# EAGLE design FlashAdapter (EAGLE 9.6.2)
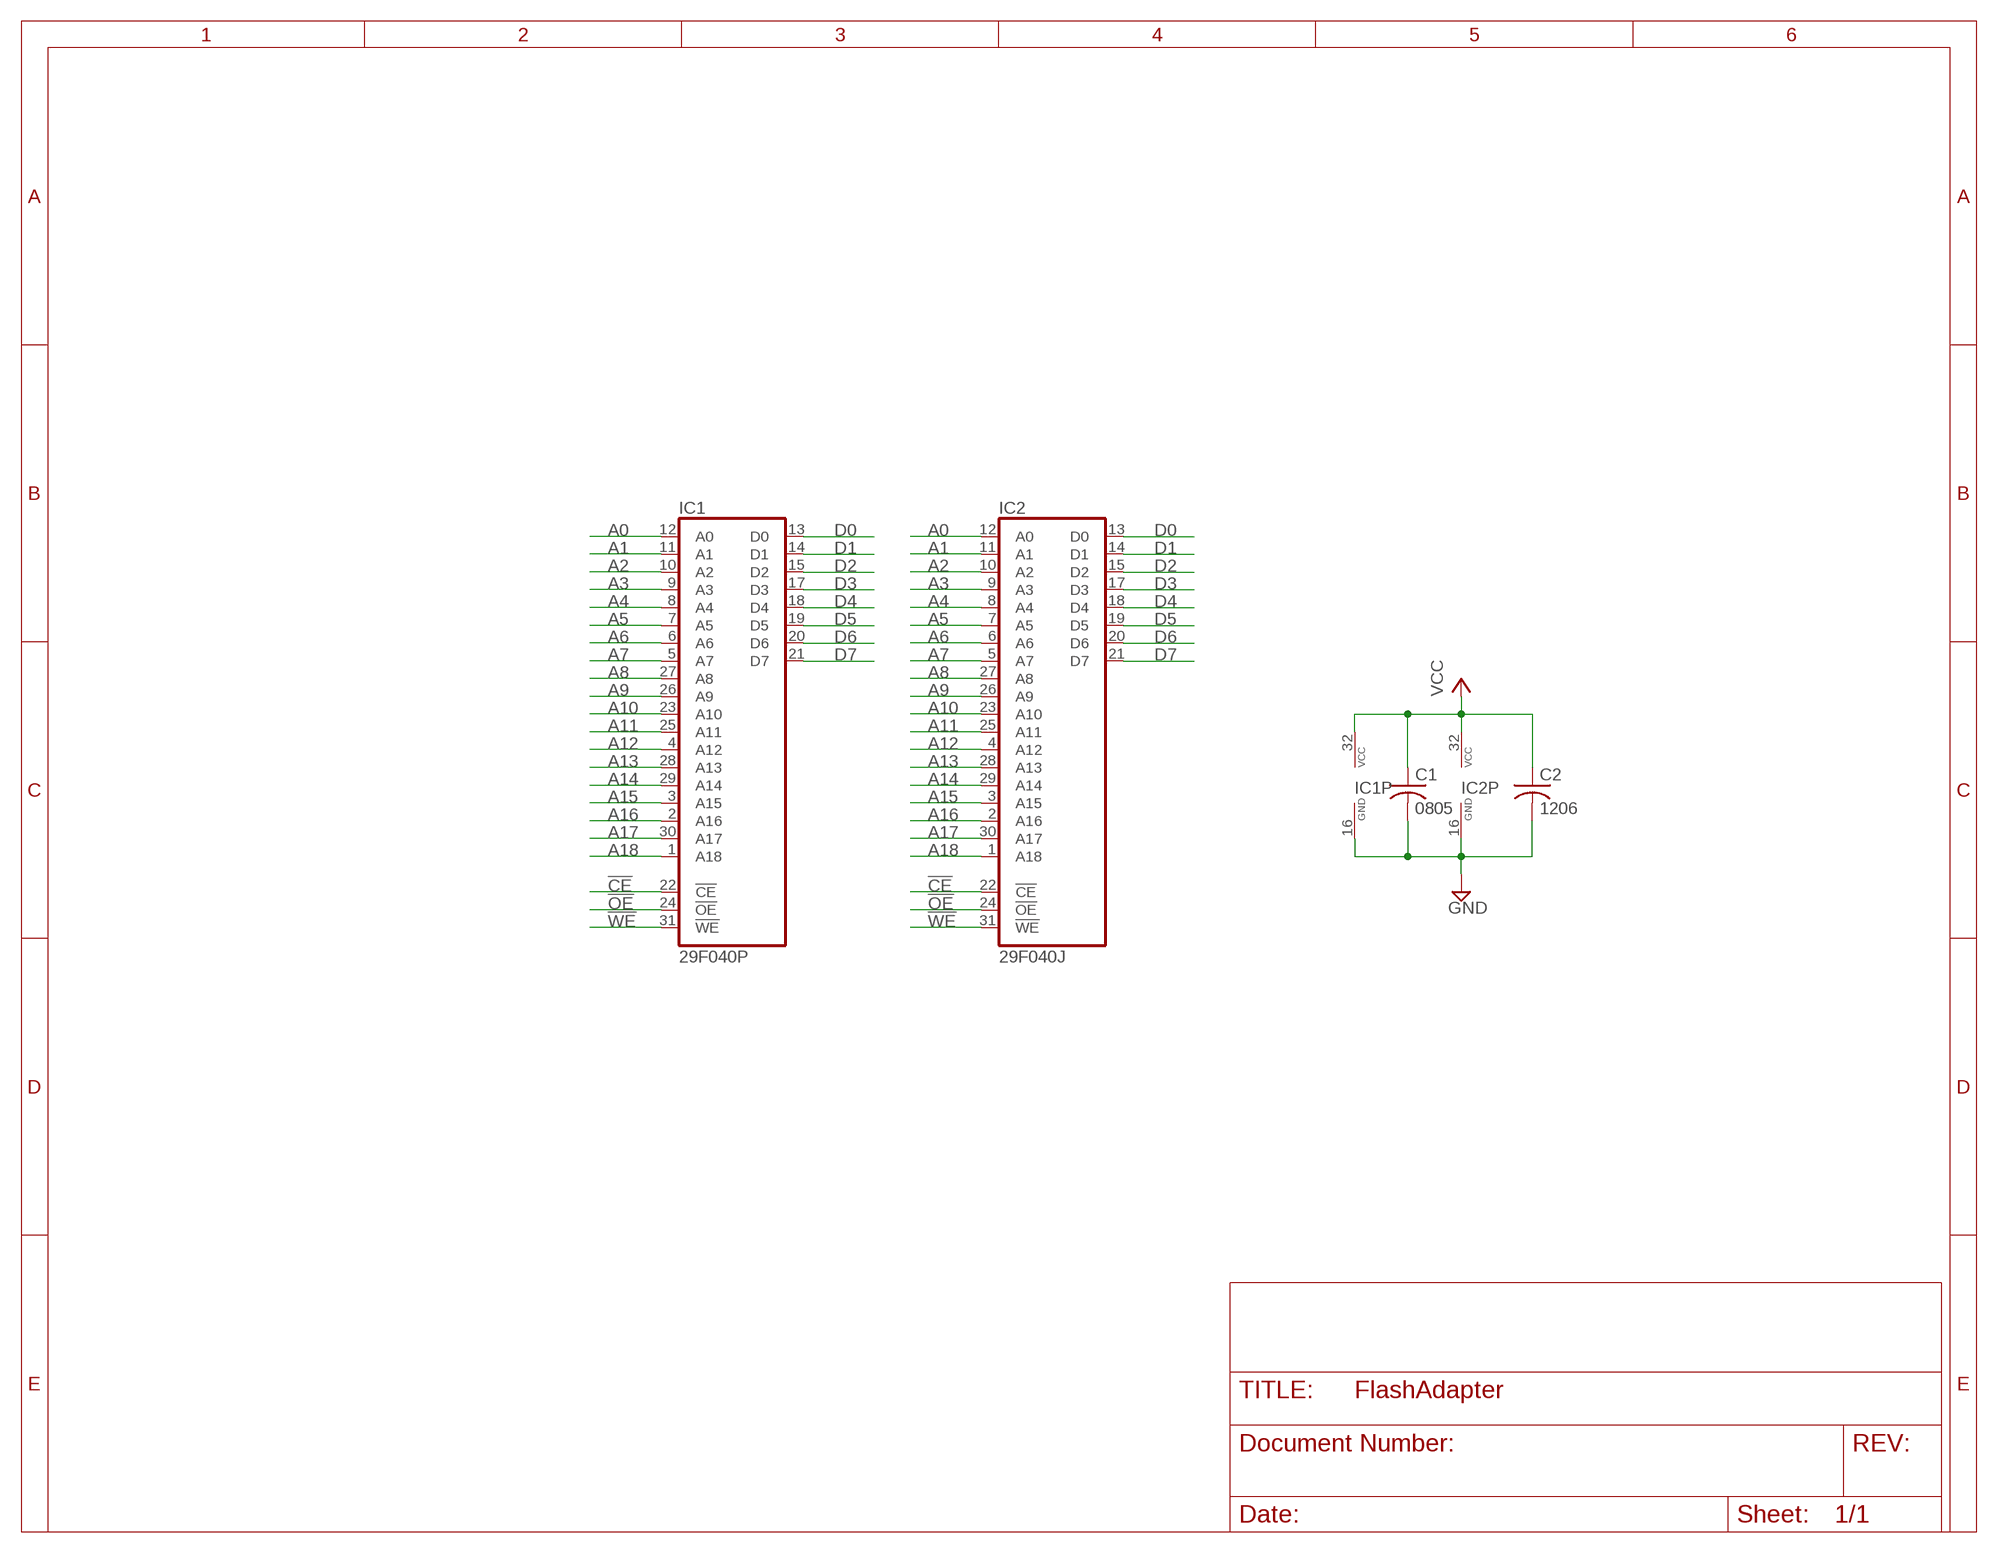
[diagram p0: schematic, sheet 1]

## Parts
C1  0805  C-USC0805  [C0805]
C2  1206  C-USC1206  [C1206]
IC1  29F040P  [DIL32-3]
IC2  29F040J  [S32]

## Nets
!CE: IC1.22(!CE) IC2.22(!CE)
!OE: IC1.24(!OE) IC2.24(!OE)
!WE: IC1.31(!WE) IC2.31(!WE)
A0: IC1.12(A0) IC2.12(A0)
A1: IC1.11(A1) IC2.11(A1)
A2: IC1.10(A2) IC2.10(A2)
A3: IC1.9(A3) IC2.9(A3)
A4: IC1.8(A4) IC2.8(A4)
A5: IC1.7(A5) IC2.7(A5)
A6: IC1.6(A6) IC2.6(A6)
A7: IC1.5(A7) IC2.5(A7)
A8: IC1.27(A8) IC2.27(A8)
A9: IC1.26(A9) IC2.26(A9)
A10: IC1.23(A10) IC2.23(A10)
A11: IC1.25(A11) IC2.25(A11)
A12: IC1.4(A12) IC2.4(A12)
A13: IC1.28(A13) IC2.28(A13)
A14: IC1.29(A14) IC2.29(A14)
A15: IC1.3(A15) IC2.3(A15)
A16: IC1.2(A16) IC2.2(A16)
A17: IC1.30(A17) IC2.30(A17)
A18: IC1.1(A18) IC2.1(A18)
D0: IC1.13(D0) IC2.13(D0)
D1: IC1.14(D1) IC2.14(D1)
D2: IC1.15(D2) IC2.15(D2)
D3: IC1.17(D3) IC2.17(D3)
D4: IC1.18(D4) IC2.18(D4)
D5: IC1.19(D5) IC2.19(D5)
D6: IC1.20(D6) IC2.20(D6)
D7: IC1.21(D7) IC2.21(D7)
GND: C1.2 C2.2 IC1.16(GND) IC2.16(GND)
VCC: C1.1 C2.1 IC1.32(VCC) IC2.32(VCC)

## Library data of the parts
C1 C2 = FlashAdapter:C-US: CAPACITOR, American symbol; SPICEPREFIX: C
IC1 IC2 = FlashAdapter:29F040: 4-Megabit FLASH MEMORY (512 K x 8 bit) 5 V-only

## Board
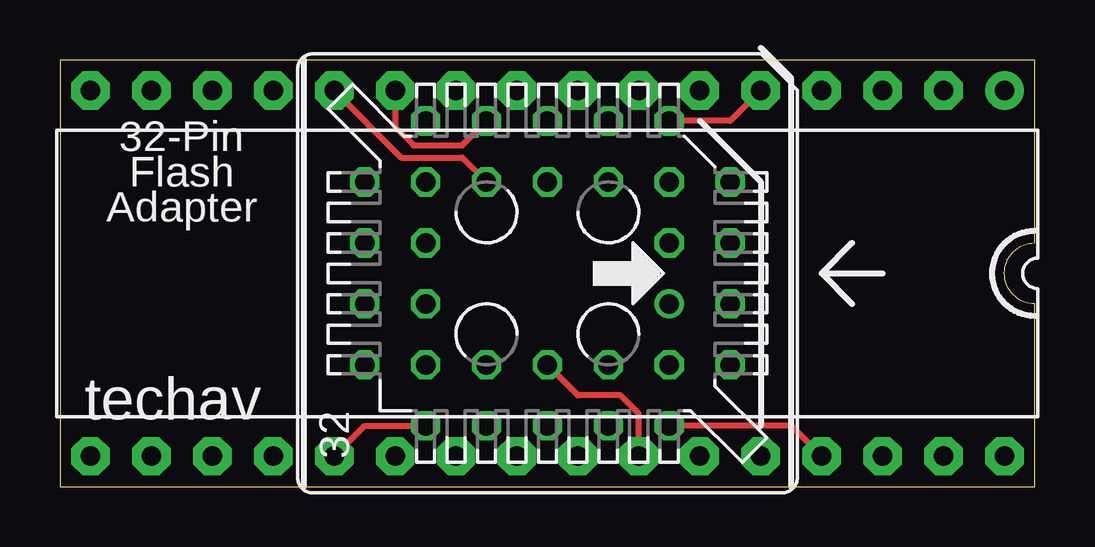
[diagram p1: board, top side]
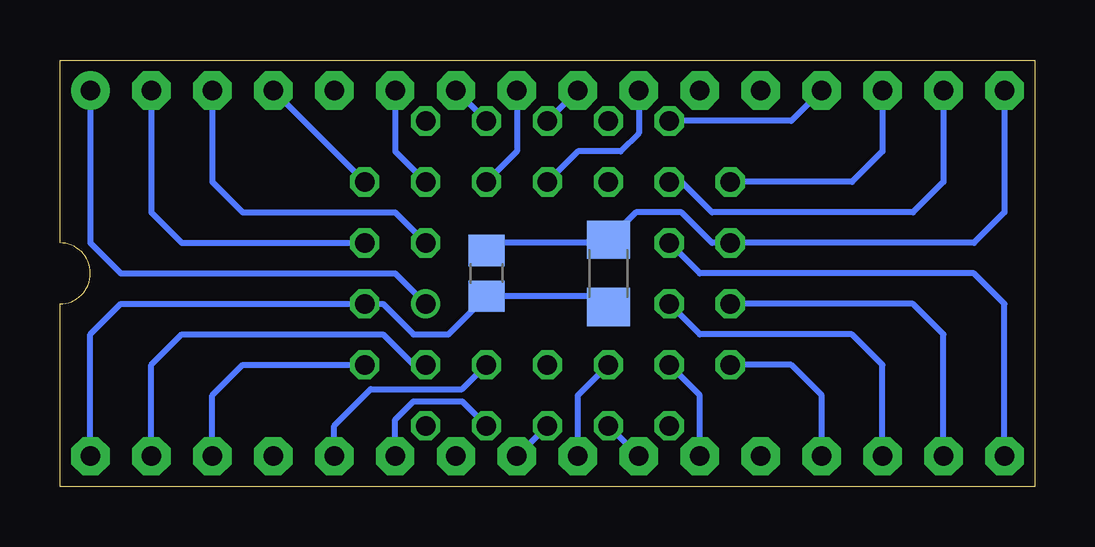
[diagram p2: board, bottom side, seen from below]

Size 40.64 x 17.78 mm. Coordinates in mm from the lower left corner, seen from the top.
Outline: 0,17.78 0,0 40.64,0 40.64,7.62 arc-180 40.64,10.16 40.64,17.78 0,17.78
Copper layers (1*16): Top 0.0356mm / dielectric 1.5011mm / Bottom 0.0356mm
Design rules "oshpark-2layer": minimum track width 6mil, minimum drill 13mil, track to track 6mil, track to pad 6mil, pad to pad 6mil, via to via 6mil, smd to smd 6mil, copper to edge 15mil, drill to drill 6mil, minimum pad ring 7mil, minimum via ring 7mil, stop-mask expansion 4mil, vias tented up to drill 0mil, thermal gap 10mil

### Footprints (pad centres in the part's own frame; a part is rotated, then mirrored left to right if it is on the bottom)
C0805 = smd 1.3 x 1.5: 1 -0.95,0; 2 0.95,0
C1206 = smd 1.6 x 1.8: 1 -1.4,0; 2 1.4,0
DIL32-3 = drill 0.813 pad 1.6: 1 -19.05,-7.62 | drill 0.813 pad 1.6 octagon: 2 -16.51,-7.62; 3 -13.97,-7.62; 4 -11.43,-7.62; 5 -8.89,-7.62; 6 -6.35,-7.62; 7 -3.81,-7.62; 8 -1.27,-7.62; 9 1.27,-7.62; 10 3.81,-7.62; 11 6.35,-7.62; 12 8.89,-7.62; 13 11.43,-7.62; 14 13.97,-7.62; 15 16.51,-7.62; 16 19.05,-7.62; 17 19.05,7.62; 18 16.51,7.62; 19 13.97,7.62; 20 11.43,7.62; 21 8.89,7.62; 22 6.35,7.62; 23 3.81,7.62; 24 1.27,7.62; 25 -1.27,7.62; 26 -3.81,7.62; 27 -6.35,7.62; 28 -8.89,7.62; 29 -11.43,7.62; 30 -13.97,7.62; 31 -16.51,7.62; 32 -19.05,7.62
S32 = drill 0.813: 1 1.27,5.08 | drill 0.813 octagon: 2 -1.27,7.62; 3 -1.27,5.08; 4 -3.81,7.62; 5 -6.35,5.08; 6 -3.81,5.08; 7 -6.35,2.54; 8 -3.81,2.54; 9 -6.35,0; 10 -3.81,0; 11 -6.35,-2.54; 12 -3.81,-2.54; 13 -6.35,-5.08; 14 -3.81,-7.62; 15 -3.81,-5.08; 16 -1.27,-7.62; 17 -1.27,-5.08; 18 1.27,-7.62; 19 1.27,-5.08; 20 3.81,-7.62; 21 6.35,-5.08; 22 3.81,-5.08; 23 6.35,-2.54; 24 3.81,-2.54; 25 6.35,0; 26 3.81,0; 27 6.35,2.54; 28 3.81,2.54; 29 6.35,5.08; 30 3.81,7.62; 31 3.81,5.08; 32 1.27,7.62

### Placement (x,y rotation side)
C1  22.86,8.89 90 bottom
C2  17.78,8.89 90 bottom
IC1  20.32,8.89 180 top
IC2  20.32,8.89 270 top

### Tracks (layer width: path | path; a pad name or v marks a point on that pad's centre or on a via)
!CE
  Bottom 0.254: IC1.22 13.97,3.81 IC2.22
!OE
  Bottom 0.254: IC1.24 19.05,3.81 IC2.24
!WE
  Bottom 0.254: IC1.31 36.83,5.08 35.56,6.35 27.18,6.35 25.91,5.08 IC2.31
A0
  Top 0.254: IC1.12 14.22,13.72 16.76,13.72 IC2.12
A1
  Top 0.254: IC2.11 16.76,14.22 14.73,14.22 13.97,14.99 IC1.11
A2
  Bottom 0.254: IC2.10 19.05,13.97 17.27,13.97 16.51,14.73 IC1.10
A3
  Bottom 0.254: IC1.9 IC2.9
A4
  Bottom 0.254: IC1.8 21.59,13.97 IC2.8
A5
  Bottom 0.254: IC1.7 IC2.7
A6
  Bottom 0.254: IC1.6 26.67,13.97 IC2.6
A7
  Top 0.254: IC1.5 27.94,15.24 IC2.5
A8
  Bottom 0.254: IC2.27 23.88,3.56 25.91,3.56 26.67,2.79 IC1.27
A9
  Top 0.254: IC2.26 21.59,3.81 23.37,3.81 24.13,3.05 IC1.26
A10
  Bottom 0.254: IC1.23 IC2.23
A11
  Bottom 0.254: IC1.25 IC2.25
A12
  Bottom 0.254: IC1.4 IC2.4
A13
  Bottom 0.254: IC1.28 29.21,2.54 27.69,4.06 23.88,4.06 IC2.28
A14
  Top 0.254: IC1.29 30.48,2.54 IC2.29
A15
  Bottom 0.254: IC1.3 34.29,12.7 33.02,11.43 26.67,11.43 IC2.3
A16
  Bottom 0.254: IC1.2 36.83,11.43 35.56,10.16 IC2.2
A17
  Bottom 0.254: IC1.30 34.29,3.81 33.02,5.08 IC2.30
A18
  Bottom 0.254: IC1.1 39.37,10.16 38.1,8.89 26.67,8.89 IC2.1
D0
  Bottom 0.254: IC1.13 10.16,15.24 IC2.13
D1
  Bottom 0.254: IC1.14 6.35,13.97 7.62,12.7 IC2.14
D2
  Bottom 0.254: IC1.15 3.81,12.7 5.08,11.43 13.46,11.43 14.73,12.7 IC2.15
D3
  Bottom 0.254: IC1.17 1.27,7.62 2.54,8.89 13.97,8.89 IC2.17
D4
  Bottom 0.254: IC1.18 3.81,6.35 5.08,7.62 IC2.18
D5
  Bottom 0.254: IC1.19 6.35,5.08 7.62,6.35 13.97,6.35 IC2.19
D6
  Bottom 0.254: IC1.20 8.89,3.81 10.16,5.08 IC2.20
D7
  Top 0.254: IC1.21 12.7,2.54 IC2.21
GND
  Bottom 0.254: IC1.16 1.27,11.43 2.54,10.16 IC2.16 13.46,10.16 14.73,11.43 16.64,11.43 C2.2 17.91,10.16 22.54,10.16 C1.2
VCC
  Bottom 0.254: IC1.32 39.37,6.35 38.1,7.62 IC2.32 27.18,7.62 25.91,6.35 24.45,6.35 C1.1 18.23,7.94 C2.1

### Text on the board
tSilk: 32-Pin / Flash / Adapter | techav